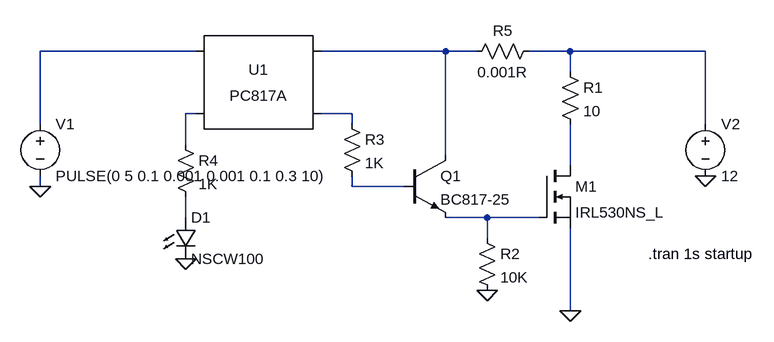
[diagram p0: schematic mosfet.asc]
mosfet.asc, the LTspice schematic file:
Version 4
SHEET 1 880 680
WIRE 0 240 -240 240
WIRE 384 240 192 240
WIRE 432 240 384 240
WIRE 576 240 512 240
WIRE 784 240 576 240
WIRE 576 272 576 240
WIRE 0 336 -16 336
WIRE 240 336 192 336
WIRE -240 352 -240 240
WIRE 240 352 240 336
WIRE 784 352 784 240
WIRE -16 384 -16 336
WIRE 384 400 384 240
WIRE 576 416 576 352
WIRE -240 448 -240 432
WIRE 240 448 240 432
WIRE 320 448 240 448
WIRE -16 496 -16 464
WIRE 448 496 384 496
WIRE 528 496 448 496
WIRE 448 528 448 496
WIRE 576 640 576 512
FLAG 576 640 0
FLAG 784 432 0
FLAG 448 608 0
FLAG -16 560 0
FLAG -240 448 0
SYMBOL Optos/PC817A 96 288 R0
SYMATTR InstName U1
SYMBOL npn 320 400 R0
SYMATTR InstName Q1
SYMATTR Value BC817-25
SYMBOL res 560 256 R0
SYMATTR InstName R1
SYMATTR Value 10
SYMBOL res 432 512 R0
SYMATTR InstName R2
SYMATTR Value 10K
SYMBOL res 224 336 R0
SYMATTR InstName R3
SYMATTR Value 1K
SYMBOL res -32 368 R0
SYMATTR InstName R4
SYMATTR Value 1K
SYMBOL voltage -240 336 R0
SYMATTR InstName V1
SYMATTR Value PULSE(0 5 0.1 0.001 0.001 0.1 0.3 10)
SYMBOL voltage 784 336 R0
SYMATTR InstName V2
SYMATTR Value 12
SYMBOL LED -32 496 R0
SYMATTR InstName D1
SYMATTR Value NSCW100
SYMBOL res 528 224 R90
WINDOW 0 0 56 VBottom 2
WINDOW 3 32 56 VTop 2
SYMATTR InstName R5
SYMATTR Value 0.001R
SYMBOL nmos 528 416 R0
SYMATTR InstName M1
SYMATTR Value IRL530NS_L
TEXT 696 552 Left 2 !.tran 1s startup

The netlist it stands for:
* mosfet.asc
XU1 N001 N004 N002 N005 PC817 Igain=1m
Q1 N002 N007 N009 0 BC817-25
R1 N003 N006 10
R2 N009 0 10K
R3 N005 N007 1K
R4 N004 N008 1K
V1 N001 0 PULSE(0 5 0.1 0.001 0.001 0.1 0.3 10)
V2 N003 0 12
D1 N008 0 NSCW100
R5 N003 N002 0.001R
M1 N006 N009 0 0 IRL530NS_L
.model D D
.lib standard.dio
.model NPN NPN
.model PNP PNP
.lib standard.bjt
.model NMOS NMOS
.model PMOS PMOS
.lib standard.mos
.tran 1s startup
.lib PC817.sub
.backanno
.end